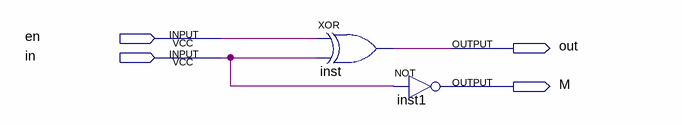
[diagram p0: schematic sheet]
// Quartus schematic nested_counter_1b_down.bdf as structural Verilog: 2 symbols, 4 pins
module nested_counter_1b_down (
  input  en,
  input  in,
  output out,
  output M
);

  xor inst (out, en, in);
  not inst1 (M, in);
endmodule
